# EAGLE schematic drv8412_breakout (EAGLE 7.1.0)
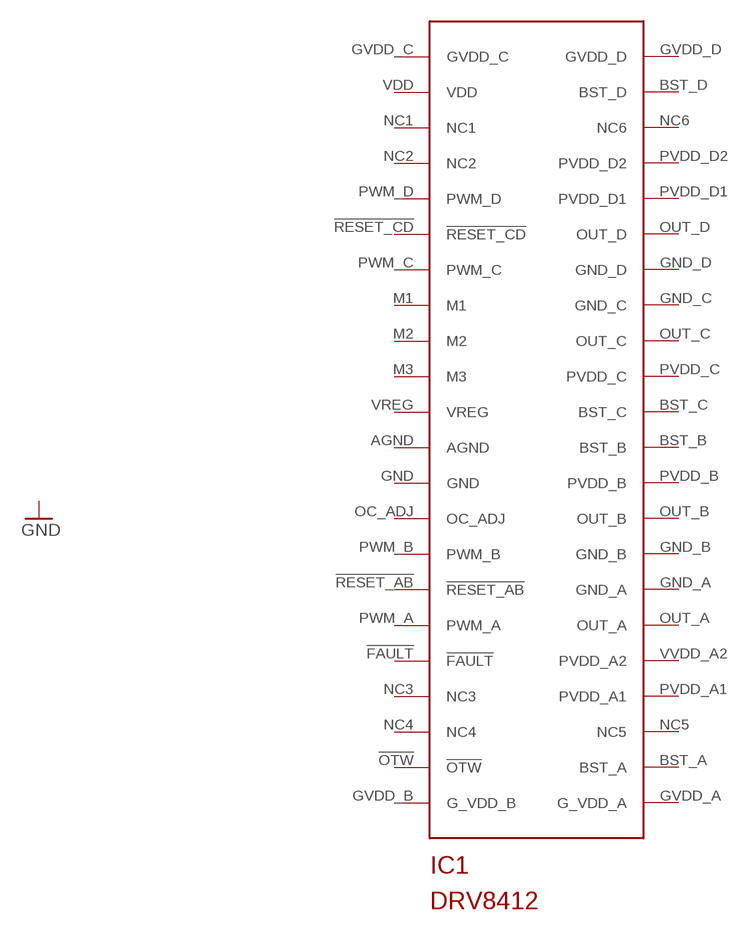
[diagram p0: schematic, sheet 1]

## Parts
IC1  DRV8412TSSOP44  [TSSOP24]
Unconnected: IC1.!FAULT! IC1.!OTW! IC1.!RESET_AB! IC1.!RESET_CD! IC1.AGND IC1.BST_A IC1.BST_B IC1.BST_C IC1.BST_D IC1.GND IC1.GND_A IC1.GND_B IC1.GND_C IC1.GND_D IC1.GVDD_A(G_VDD_A) IC1.GVDD_B(G_VDD_B) IC1.GVDD_C IC1.GVDD_D IC1.M1 IC1.M2 IC1.M3 IC1.NC1 IC1.NC2 IC1.NC3 IC1.NC4 IC1.NC5 IC1.NC6 IC1.OC_ADJ IC1.OUT_A IC1.OUT_B IC1.OUT_C IC1.OUT_D IC1.PVDD_A1 IC1.PVDD_B IC1.PVDD_C IC1.PVDD_D1 IC1.PVDD_D2 IC1.PWM_A IC1.PWM_B IC1.PWM_C IC1.PWM_D IC1.VDD IC1.VREG IC1.VVDD_A2(PVDD_A2)

## Library data of the parts
IC1 = DRV8412:DRV8412: DRV8412 TSSOP44